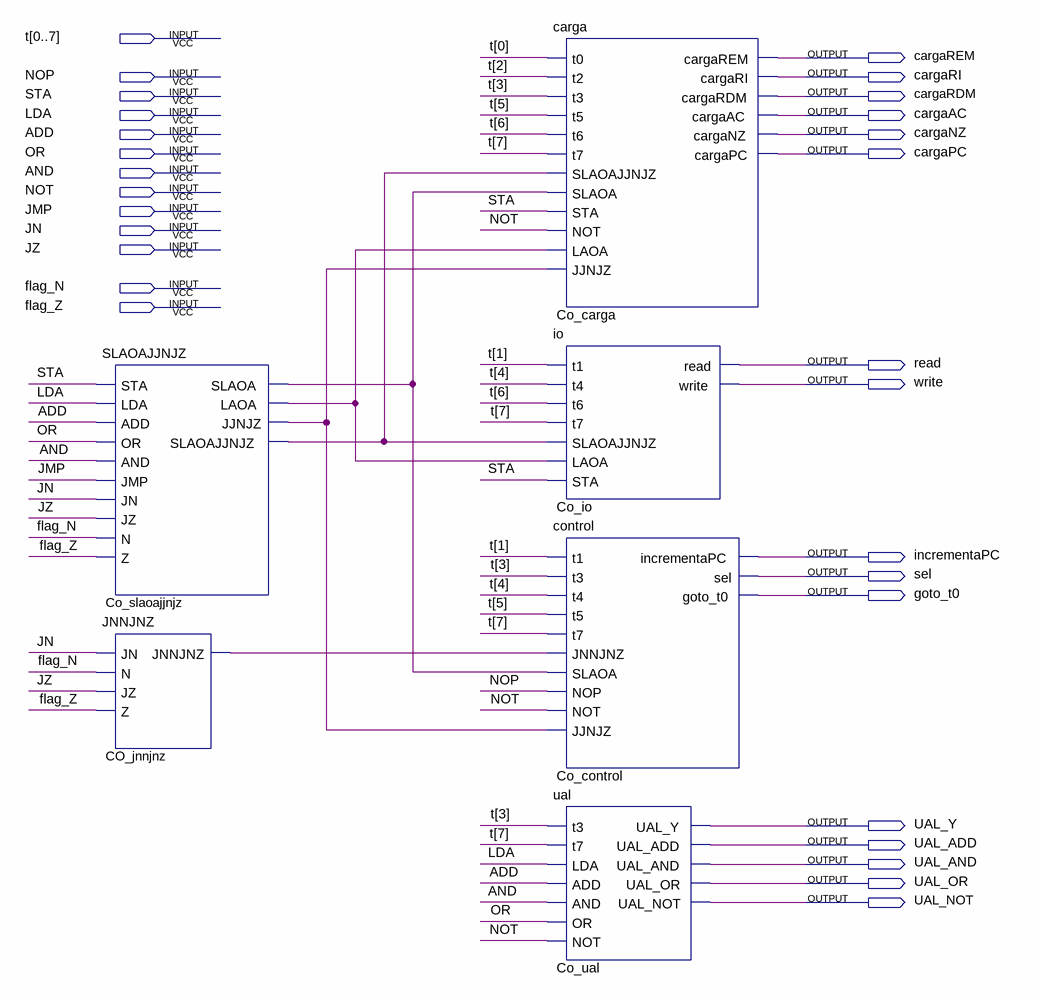
[diagram p0: schematic sheet]
// Quartus schematic teste_uc.bdf as structural Verilog: 6 symbols, 29 pins
module teste_uc (
  input  [0:7] t,
  input  NOP,
  input  STA,
  input  LDA,
  input  ADD,
  input  OR,
  input  AND,
  input  NOT,
  input  JMP,
  input  JN,
  input  JZ,
  input  flag_N,
  input  flag_Z,
  output cargaREM,
  output cargaRI,
  output cargaRDM,
  output cargaAC,
  output cargaNZ,
  output cargaPC,
  output read,
  output write,
  output incrementaPC,
  output sel,
  output goto_t0,
  output UAL_Y,
  output UAL_ADD,
  output UAL_AND,
  output UAL_OR,
  output UAL_NOT
);

  wire CO_jnnjnz_jnnjnz, Co_slaoajjnjz_jjnjz, Co_slaoajjnjz_laoa, Co_slaoajjnjz_slaoa,
       Co_slaoajjnjz_slaoajjnjz;

  SLAOAJJNJZ Co_slaoajjnjz (
    .STA(STA), .LDA(LDA), .ADD(ADD), .OR(OR), .AND(AND), .JMP(JMP), .JN(JN), .JZ(JZ), .N(flag_N), .Z(flag_Z),
    .SLAOA(Co_slaoajjnjz_slaoa), .LAOA(Co_slaoajjnjz_laoa), .JJNJZ(Co_slaoajjnjz_jjnjz),
    .SLAOAJJNJZ(Co_slaoajjnjz_slaoajjnjz));
  JNNJNZ CO_jnnjnz (.JN(JN), .N(flag_N), .JZ(JZ), .Z(flag_Z), .JNNJNZ(CO_jnnjnz_jnnjnz));
  carga Co_carga (
    .t0(t[0]), .t2(t[2]), .t3(t[3]), .t5(t[5]), .t6(t[6]), .t7(t[7]), .SLAOAJJNJZ(Co_slaoajjnjz_slaoajjnjz),
    .SLAOA(Co_slaoajjnjz_slaoa), .STA(STA), .NOT(NOT), .LAOA(Co_slaoajjnjz_laoa),
    .JJNJZ(Co_slaoajjnjz_jjnjz), .cargaREM(cargaREM), .cargaRI(cargaRI), .cargaRDM(cargaRDM),
    .cargaAC(cargaAC), .cargaNZ(cargaNZ), .cargaPC(cargaPC));
  io Co_io (
    .t1(t[1]), .t4(t[4]), .t6(t[6]), .t7(t[7]), .SLAOAJJNJZ(Co_slaoajjnjz_slaoajjnjz),
    .LAOA(Co_slaoajjnjz_laoa), .STA(STA), .read(read), .write(write));
  control Co_control (
    .t1(t[1]), .t3(t[3]), .t4(t[4]), .t5(t[5]), .t7(t[7]), .JNNJNZ(CO_jnnjnz_jnnjnz),
    .SLAOA(Co_slaoajjnjz_slaoa), .NOP(NOP), .NOT(NOT), .JJNJZ(Co_slaoajjnjz_jjnjz),
    .incrementaPC(incrementaPC), .sel(sel), .goto_t0(goto_t0));
  ual Co_ual (
    .t3(t[3]), .t7(t[7]), .LDA(LDA), .ADD(ADD), .AND(AND), .OR(OR), .NOT(NOT), .UAL_Y(UAL_Y),
    .UAL_ADD(UAL_ADD), .UAL_AND(UAL_AND), .UAL_OR(UAL_OR), .UAL_NOT(UAL_NOT));
endmodule
